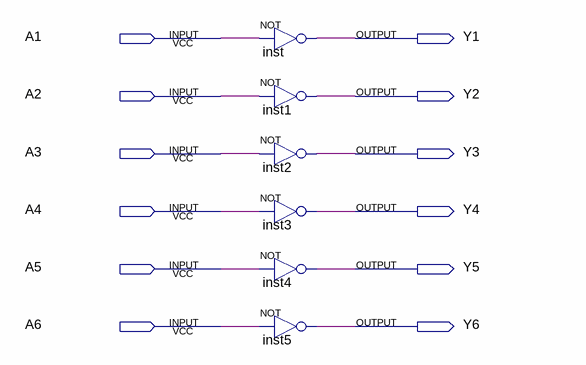
[diagram p0: schematic sheet]
// Quartus schematic SN74LS04.bdf as structural Verilog: 6 symbols, 12 pins
module SN74LS04 (
  input  A1,
  input  A2,
  input  A3,
  input  A4,
  input  A5,
  input  A6,
  output Y1,
  output Y2,
  output Y3,
  output Y4,
  output Y5,
  output Y6
);

  not inst (Y1, A1);
  not inst1 (Y2, A2);
  not inst2 (Y3, A3);
  not inst3 (Y4, A4);
  not inst4 (Y5, A5);
  not inst5 (Y6, A6);
endmodule
